# Altium schematic sheet CAN.SchDoc: Gimbal CAN Schematic
size Letter; Author: Jing Hao Yao; DrawnBy: Jing Hao Yao; Organization: UW Robotics; Address1: 200 University Avenue; Address2: Waterloo; Address3: Ontario; Address4: Canada N2L 3G6; SheetNumber: 2; SheetTotal: 5
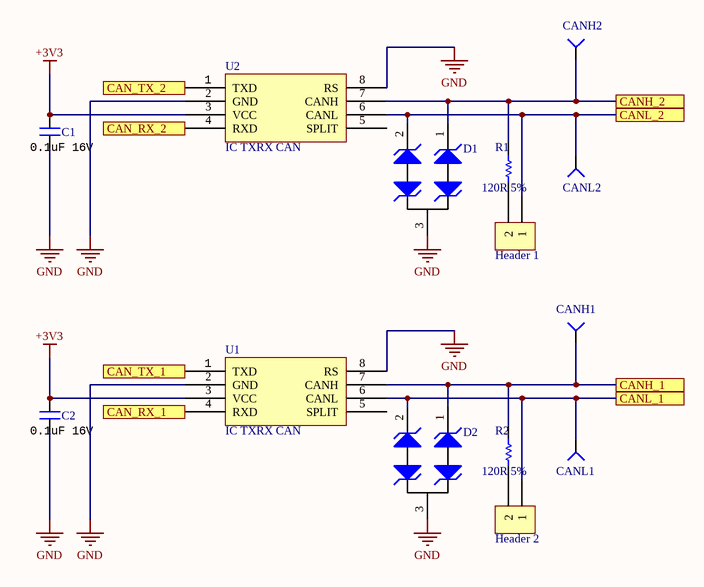
[diagram p0: CAN.SchDoc]

## Parts
C1  value 0.1uF 16V  [CAPC0603(1608)55_N]
C2  value 0.1uF 16V  [CAPC0603(1608)55_N]
D1  (no value)  [NXP-SOT323-3]
D2  (no value)  [NXP-SOT323-3]
Header_1  (no value)  [OSTYK51102030]
Header_2  (no value)  [OSTYK51102030]
R1  value 120R 5%  [RESC0603(1608)_N]
R2  value 120R 5%  [RESC0603(1608)_N]
TP4  CANH2  [TESTPOINT]
TP5  CANL2  [TESTPOINT]
TP6  CANH1  [TESTPOINT]
TP7  CANL1  [TESTPOINT]
U1  IC TXRX CAN  [LT-S8_N]
U2  IC TXRX CAN  [LT-S8_N]

## Ports
CAN_RX_1, CAN_RX_2, CAN_TX_1, CAN_TX_2, CANH_1, CANH_2, CANL_1, CANL_2

## Nets
+3V3: C1.2 C2.2 U1.3(VCC) U2.3(VCC)
GND: C1.1 C2.1 D1.3 D2.3 U1.2(GND) U1.8(RS) U2.2(GND) U2.8(RS)
CAN_RX_1: U1.4(RXD) ; port CAN_RX_1
CAN_RX_2: U2.4(RXD) ; port CAN_RX_2
CAN_TX_1: U1.1(TXD) ; port CAN_TX_1
CAN_TX_2: U2.1(TXD) ; port CAN_TX_2
CANH_1: D2.1 R2.1 TP6.1(=value) U1.7(CANH) ; port CANH_1
CANH_2: D1.1 R1.1 TP4.1(=value) U2.7(CANH) ; port CANH_2
CANL_1: D2.2 Header_2.1 TP7.1(=value) U1.6(CANL) ; port CANL_1
CANL_2: D1.2 Header_1.1 TP5.1(=value) U2.6(CANL) ; port CANL_2
NetHeader_1_2: Header_1.2 R1.2
NetHeader_2_2: Header_2.2 R2.2

Not connected (* = marked no-connect by the designer): U1 5(SPLIT); U2 5(SPLIT)

## Notes on the sheet
- Title
- Size:
- Date:
- Letter
- Drawn By:
- Sheet
- of
- File:

## Library data of the parts
C1 C2 = CAP_0.1uF_16V_0603: CAP CER 0.1UF 16V X7R 0603; MPN: CC0603KRX7R7BB104; Manufacturer: Yageo; Dimensions: 0.063" L x 0.031" W (1.60mm x 0.80mm); Package: 0603 (1608 Metric); Temperature Coefficient: X7R; Voltage Rating: 16V; Digikey Part Number: 311-1088-1-ND
D1 D2 = TVS_DIODE_CAN: TVS DIODE 24V 41V SOT323-3; MPN: PESD2CAN,215; Manufacturer: Nexperia USA Inc.; Package: SC-70, SOT-323; ComponentLink1Description: Datasheet; ComponentLink1URL: https://assets.nexperia.com/documents/data-sheet/PESD1CAN-U.pdf; Digikey Part Number: 1727-3891-1-ND
Header_1 Header_2 = TERMINAL_2: Header, 2-Pin; Manufacturer: On Shore Technology Inc.; MPN: OSTYK51102030; Digikey Part Number: ED2953-ND
R1 R2 = RES_120R_0603: RES SMD 120 OHM 5% 1/10W 0603; Manufacturer: Yageo; MPN: RC0603JR-07120RL; Package: 0603 (1608 Metric); Dimensions: 0.063" L x 0.031" W (1.60mm x 0.80mm); Tolerance: 5%; Digikey Part Number: 311-120GRCT-ND
TP4-TP7 = TESTPOINT_SMD: Part Number (MPN): *
U1 U2 = LTC2875: IC TXRX CAN 4MBPS 8SO; Manufacturer: Linear Technologies; MPN: LTC2875IS8#PBF; Package: 8-SOIC (0.154", 3.90mm Width); ComponentLink1Description: Datasheet; ComponentLink1URL: https://www.analog.com/media/en/technical-documentation/data-sheets/2875f.pdf; Digikey Part Number: LTC2875IS8#PBF-ND